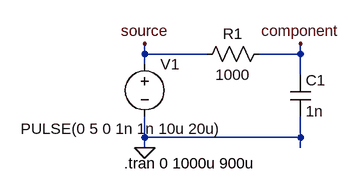
[diagram p0: schematic ltspice_simulation.asc]
ltspice_simulation.asc, the LTspice schematic file:
Version 4
SHEET 1 880 680
WIRE -80 -16 -80 -32
WIRE 16 -16 -80 -16
WIRE 160 -16 160 -32
WIRE 160 -16 96 -16
WIRE -80 0 -80 -16
WIRE 160 16 160 -16
WIRE -80 112 -80 80
WIRE 160 112 160 80
WIRE 160 112 -80 112
WIRE -80 128 -80 112
WIRE 160 128 160 112
FLAG -80 128 0
FLAG -80 -32 source
FLAG 160 -32 component
SYMBOL res 112 -32 R90
WINDOW 0 0 56 VBottom 2
WINDOW 3 32 56 VTop 2
SYMATTR InstName R1
SYMATTR Value 1000
SYMBOL voltage -80 -16 R0
WINDOW 123 0 0 Left 0
WINDOW 39 0 0 Left 0
WINDOW 3 -191 115 Left 2
SYMATTR Value PULSE(0 5 0 1n 1n 10u 20u)
SYMATTR InstName V1
SYMBOL cap 144 16 R0
SYMATTR InstName C1
SYMATTR Value 1n
TEXT -112 152 Left 2 !.tran 0 1000u 900u

The netlist it stands for:
* ltspice_simulation.asc
R1 component source 1000
V1 source 0 PULSE(0 5 0 1n 1n 10u 20u)
C1 component 0 1n
.tran 0 1000u 900u
.backanno
.end

* Results of the author's LTspice run, read from the files saved beside the schematic
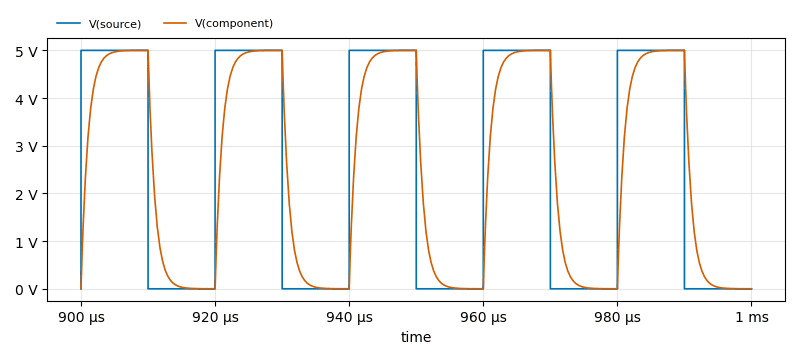
[diagram p1: Transient Analysis of ltspice_simulation.asc, plotted from the saved traces]
* Transient Analysis, 1 run:
*   V(source): min 0 V, max 5 V, average 2.5 V, rms 3.536 V, last 0 V
*   V(component): min 202.6 µV, max 5 V, average 2.5 V, rms 3.355 V, last 202.6 µV